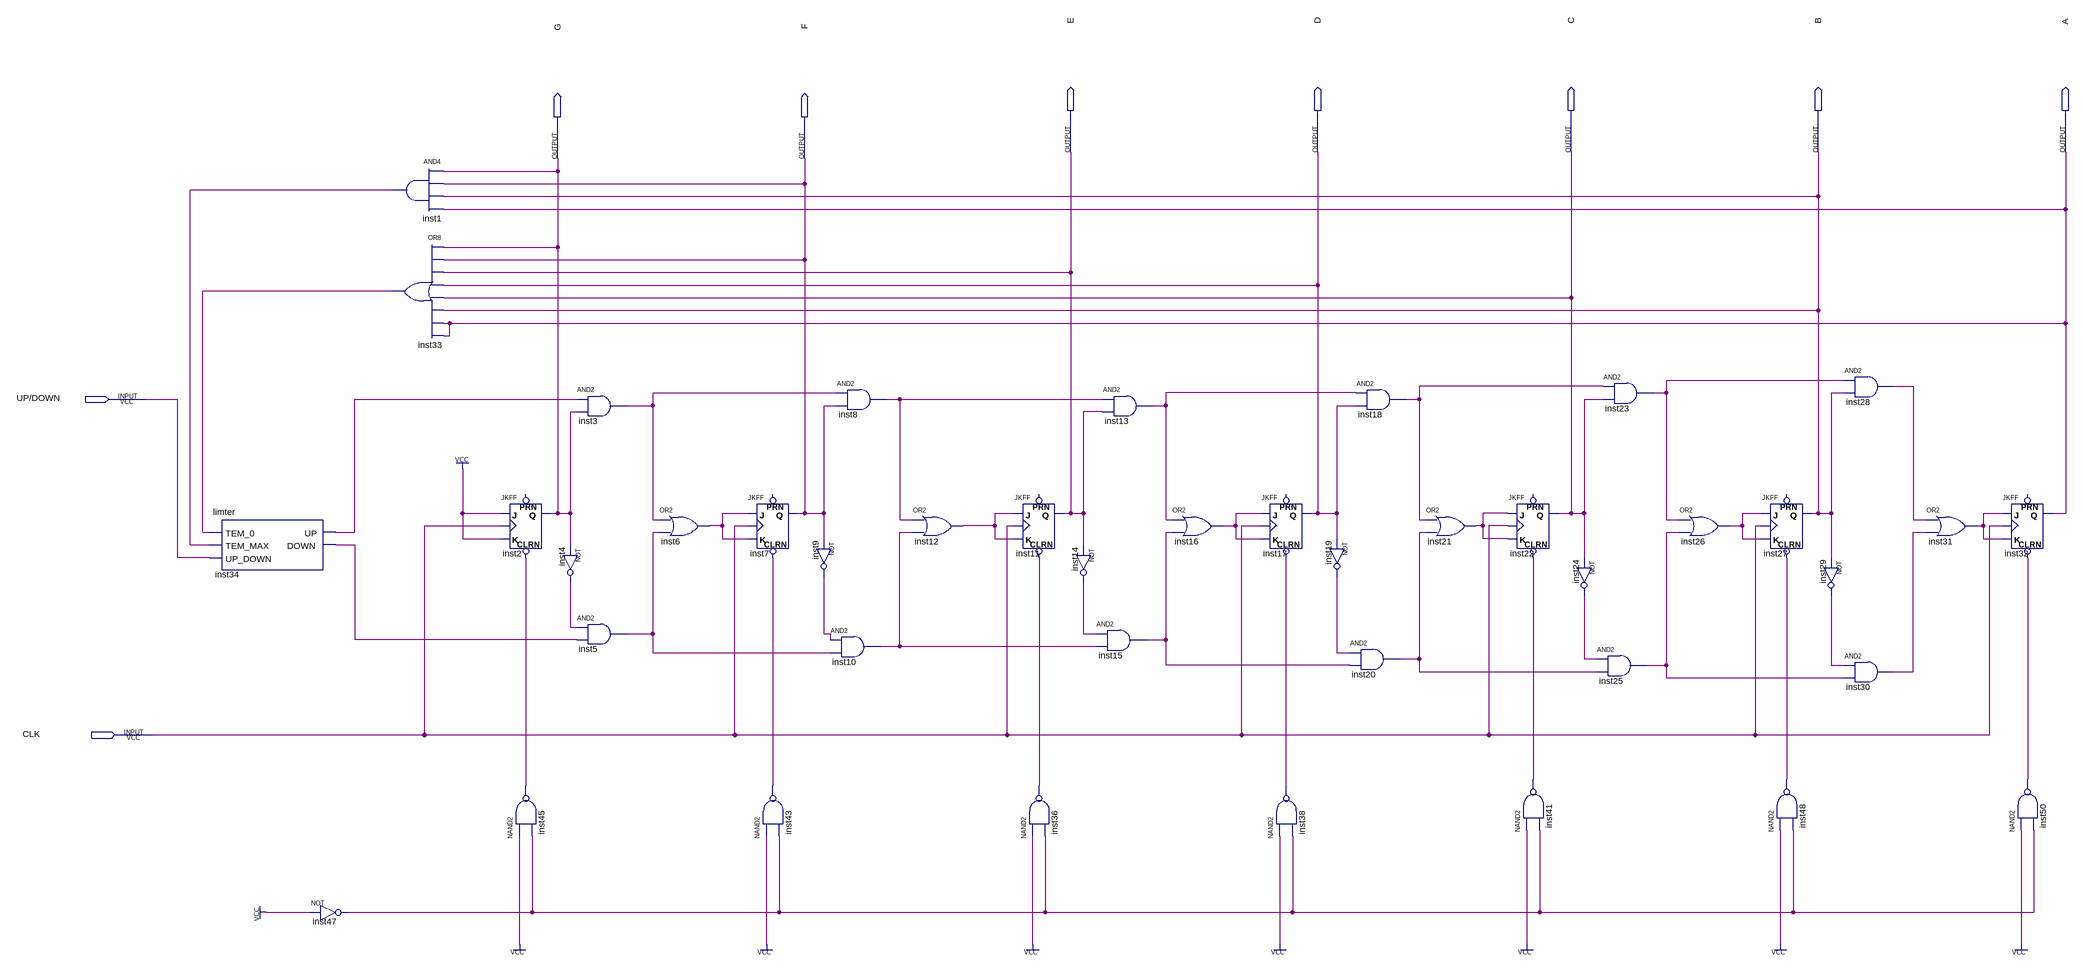
[diagram p0: schematic sheet]
// Quartus schematic 8bit_counter.bdf as structural Verilog: 42 symbols, 9 pins
module \8bit_counter  (
  input  \UP/DOWN ,
  input  CLK,
  output E,
  output D,
  output C,
  output B,
  output A,
  output G,
  output F
);

  wire inst1_out, inst3_out, inst4_out, inst5_out, inst6_out, inst8_out, inst9_out, inst10_out, inst12_out,
       inst13_out, inst14_out, inst15_out, inst16_out, inst18_out, inst19_out, inst20_out, inst21_out,
       inst23_out, inst24_out, inst25_out, inst26_out, inst28_out, inst29_out, inst30_out, inst31_out,
       inst33_out, inst34_down, inst34_up, inst36_out, inst38_out, inst41_out, inst43_out, inst45_out,
       inst47_out, inst48_out, inst50_out;

  limter inst34 (.TEM_0(inst33_out), .TEM_MAX(inst1_out), .UP_DOWN(\UP/DOWN ), .UP(inst34_up), .DOWN(inst34_down));
  not inst47 (inst47_out, 1'b1);
  and inst1 (inst1_out, G, F, B, A);
  or inst33 (inst33_out, G, F, E, D, C, B, A, A);
  JKFF inst2 (.CLRN(inst45_out), .K(1'b1), .J(1'b1), .CLK(CLK), .Q(G));  // open: PRN
  nand inst45 (inst45_out, 1'b1, inst47_out);
  and inst3 (inst3_out, inst34_up, G);
  not inst4 (inst4_out, G);
  and inst5 (inst5_out, inst4_out, inst34_down);
  or inst6 (inst6_out, inst3_out, inst5_out);
  JKFF inst7 (.CLRN(inst43_out), .K(inst6_out), .J(inst6_out), .CLK(CLK), .Q(F));  // open: PRN
  nand inst43 (inst43_out, 1'b1, inst47_out);
  and inst8 (inst8_out, inst3_out, F);
  not inst9 (inst9_out, F);
  and inst10 (inst10_out, inst9_out, inst5_out);
  or inst12 (inst12_out, inst8_out, inst10_out);
  JKFF inst11 (.CLRN(inst36_out), .K(inst12_out), .J(inst12_out), .CLK(CLK), .Q(E));  // open: PRN
  nand inst36 (inst36_out, 1'b1, inst47_out);
  not inst14 (inst14_out, E);
  and inst15 (inst15_out, inst14_out, inst10_out);
  and inst13 (inst13_out, inst8_out, E);
  or inst16 (inst16_out, inst13_out, inst15_out);
  JKFF inst17 (.CLRN(inst38_out), .K(inst16_out), .J(inst16_out), .CLK(CLK), .Q(D));  // open: PRN
  nand inst38 (inst38_out, 1'b1, inst47_out);
  not inst19 (inst19_out, D);
  and inst20 (inst20_out, inst19_out, inst15_out);
  and inst18 (inst18_out, inst13_out, D);
  or inst21 (inst21_out, inst18_out, inst20_out);
  JKFF inst22 (.CLRN(inst41_out), .K(inst21_out), .J(inst21_out), .CLK(CLK), .Q(C));  // open: PRN
  nand inst41 (inst41_out, 1'b1, inst47_out);
  and inst23 (inst23_out, inst18_out, C);
  not inst24 (inst24_out, C);
  and inst25 (inst25_out, inst24_out, inst20_out);
  or inst26 (inst26_out, inst23_out, inst25_out);
  JKFF inst27 (.CLRN(inst48_out), .K(inst26_out), .J(inst26_out), .CLK(CLK), .Q(B));  // open: PRN
  nand inst48 (inst48_out, 1'b1, inst47_out);
  and inst28 (inst28_out, inst23_out, B);
  not inst29 (inst29_out, B);
  and inst30 (inst30_out, inst29_out, inst25_out);
  or inst31 (inst31_out, inst28_out, inst30_out);
  JKFF inst32 (.CLRN(inst50_out), .K(inst31_out), .J(inst31_out), .CLK(CLK), .Q(A));  // open: PRN
  nand inst50 (inst50_out, 1'b1, inst47_out);
endmodule
